# EAGLE design NextOne_R2 (EAGLE 9.6.0)
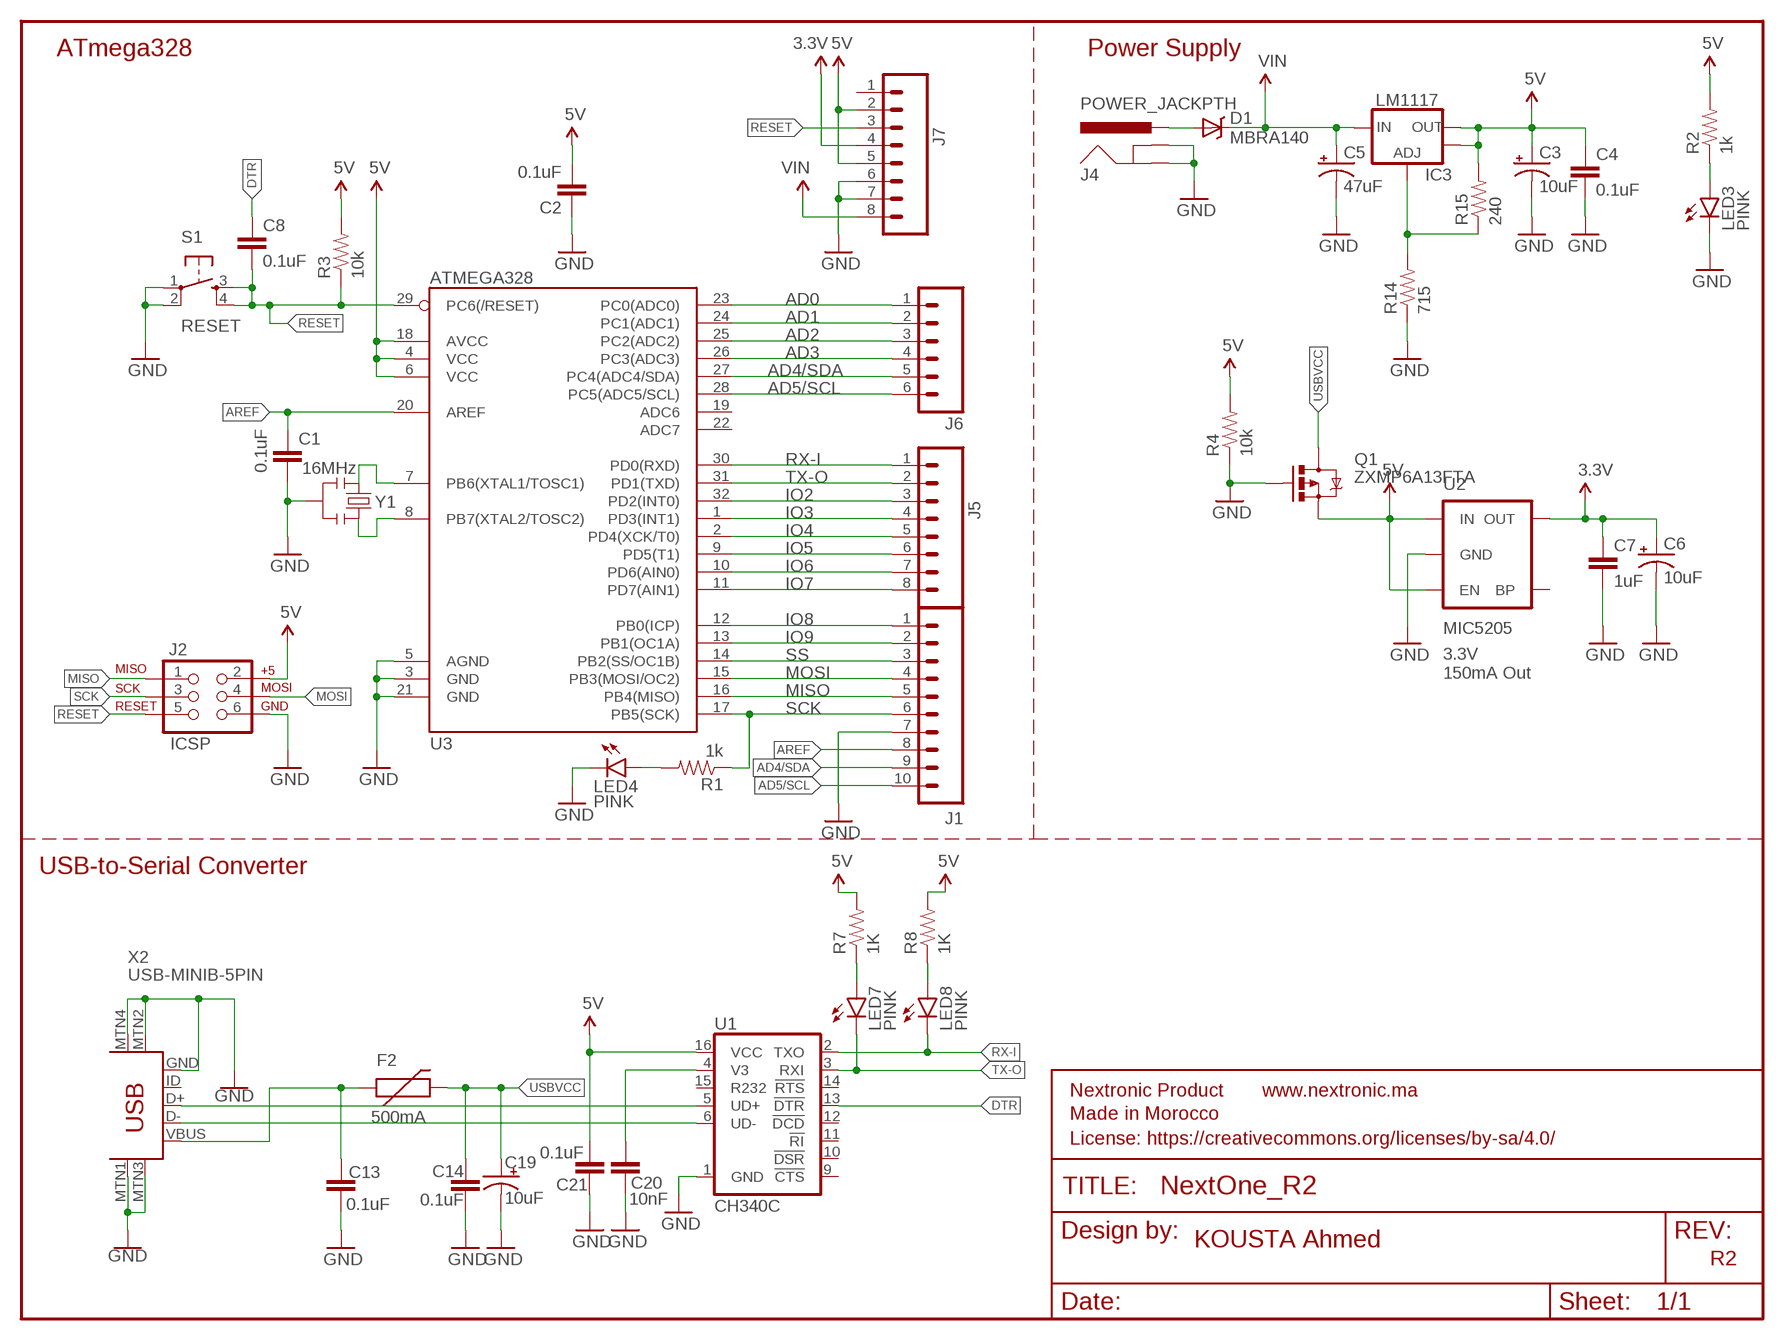
[diagram p0: schematic, sheet 1]

## Parts
C1  0.1uF  CAP0603-CAP  [0603-CAP]
C2  0.1uF  CAP0603-CAP  [0603-CAP]
C3  10uF  CAP_POL1206  [EIA3216]
C4  0.1uF  CAP0603-CAP  [0603-CAP]
C5  47uF  CAP_POLD  [PANASONIC_D]
C6  10uF  CAP_POL1206  [EIA3216]
C7  1uF  CAP0603-CAP  [0603-CAP]
C8  0.1uF  CAP0603-CAP  [0603-CAP]
C13  0.1uF  0.1UF-0603-25V-(+80/-20%)  [0603]
C14  0.1uF  0.1UF-0603-25V-(+80/-20%)  [0603]
C19  10uF  10UF-POLAR-EIA3216-16V-10%(TANT)  [EIA3216]
C20  10nF  10NF-0603-50V-10%  [0603]
C21  0.1uF  0.1UF-0603-25V-(+80/-20%)  [0603]
D1  MBRA140  DIODE-SCHOTTKY_  [SMA-DIODE]
F2  500mA  PTCSMD  [PTC-1206]
FRAME1  FRAME-LETTER  [CREATIVE_COMMONS]
IC3  LM1117  V_REG_LM1117ALT1  [SOT223-ALT1]
J1  M10SILK_FEMALE_PTH  [1X10]
J2  ICSP  AVR_SPI_PRG_6PTH  [2X3]
J4  POWER_JACKPTH  [POWER_JACK_PTH]
J5  M08  [1X08_ROUND]
J6  M06SILK_FEMALE_PTH  [1X06]
J7  M08  [1X08_ROUND]
LED3  PINK  LED-PINK1206  [LED-1206@1]
LED4  PINK  LED-PINK1206  [LED-1206@1]
LED7  PINK  LED-PINK1206  [LED-1206@1]
LED8  PINK  LED-PINK1206  [LED-1206@1]
Q1  ZXMP6A13FTA  MOSFET-PCHANNELSMD  [SOT23-3]
R1  1k  RESISTOR0603-RES  [0603-RES]
R2  1k  RESISTOR0603-RES  [0603-RES]
R3  10k  RESISTOR0603-RES  [0603-RES]
R4  10k  RESISTOR0603-RES  [0603-RES]
R7  1K  1KOHM-1/10W-1%(0603)  [0603-RES]
R8  1K  1KOHM-1/10W-1%(0603)  [0603-RES]
R14  715  RESISTOR0603-RES  [0603-RES]
R15  240  RESISTOR0603-RES  [0603-RES]
S1  RESET  TAC_SWITCHSMD  [TACTILE_SWITCH_SMD]
U1  CH340C  [SO016]
U2  MIC5205  V_REG_LDOSMD  [SOT23-5]
U3  ATMEGA328  ATMEGA168  [TQFP32-08]
X2  USB-MINIB-5PIN  [USB-MINIB]
Y1  16MHz  RESONATORSMD  [RESONATOR-SMD]

## Nets
3.3V: C6.A(+) C7.1 J7.4 U2.5(OUT)
5V: C2.2 C3.A(+) C4.1 C21.1 IC3.2(OUT) IC3.4(OUT) J2.2 J7.2 J7.5 Q1.2(S) R2.2 R3.2 R4.2 R7.2 R8.2 R15.2 U1.16(VCC) U2.1(IN) U2.3(EN) U3.4(VCC) U3.6(VCC) U3.18(AVCC)
AD0: J6.1 U3.23(PC0(ADC0))
AD1: J6.2 U3.24(PC1(ADC1))
AD2: J6.3 U3.25(PC2(ADC2))
AD3: J6.4 U3.26(PC3(ADC3))
AD4/SDA: J1.9 J6.5 U3.27(PC4(ADC4/SDA))
AD5/SCL: J1.10 J6.6 U3.28(PC5(ADC5/SCL))
AREF: C1.1 J1.8 U3.20(AREF)
D+1: U1.5(UD+) X2.D+
D-1: U1.6(UD-) X2.D-
DTR: C8.1 U1.13(!DTR)
GND: C1.2 C2.1 C3.C(-) C4.2 C5.- C6.C(-) C7.2 C13.2 C14.2 C19.- C20.2 C21.2 J1.7 J2.6 J4.GND J4.GNDBREAK J7.6 J7.7 LED3.C LED4.C Q1.1(G) R4.1 R14.1 S1.1 S1.2 U1.1(GND) U2.2(GND) U3.3(GND) U3.5(AGND) U3.21(GND) X2.GND X2.MTN1(MTN2) X2.MTN2(MTN3) X2.MTN3(MTN1) X2.MTN4 Y1.2
IO2: J5.3 U3.32(PD2(INT0))
IO3: J5.4 U3.1(PD3(INT1))
IO4: J5.5 U3.2(PD4(XCK/T0))
IO5: J5.6 U3.9(PD5(T1))
IO6: J5.7 U3.10(PD6(AIN0))
IO7: J5.8 U3.11(PD7(AIN1))
IO8: J1.1 U3.12(PB0(ICP))
IO9: J1.2 U3.13(PB1(OC1A))
MISO: J1.5 J2.1 U3.16(PB4(MISO))
MOSI: J1.4 J2.4 U3.15(PB3(MOSI/OC2))
N$1: LED4.A R1.2
N$2: LED3.A R2.1
N$3: U3.7(PB6(XTAL1/TOSC1)) Y1.1
N$4: U3.8(PB7(XTAL2/TOSC2)) Y1.3
N$5: D1.A J4.PWR
N$8: LED7.A R7.1
N$10: LED8.A R8.1
N$14: C20.1 U1.4(V3)
N$15: IC3.1(ADJ) R14.2 R15.1
RESET: C8.2 J2.5 J7.3 R3.1 S1.3 S1.4 U3.29(PC6(/RESET))
RX-I: J5.1 LED8.C U1.2(TXO) U3.30(PD0(RXD))
SCK: J1.6 J2.3 R1.1 U3.17(PB5(SCK))
SS: J1.3 U3.14(PB2(SS/OC1B))
TX-O: J5.2 LED7.C U1.3(RXI) U3.31(PD1(TXD))
USBVCC: C14.1 C19.+ F2.2 Q1.3(D)
VIN: C5.+ D1.C IC3.3(IN) J7.8
VUSB1 [power]: C13.1 F2.1 X2.VBUS
Unconnected: J7.1 U1.9(!CTS) U1.10(!DSR) U1.11(!RI) U1.12(!DCD) U1.14(!RTS) U1.15(R232) U2.4(BP) U3.19(ADC6) U3.22(ADC7) X2.ID

## Notes on the sheet
- ATmega328 | Power Supply
- 3.3V
  150mA Out
- USB-to-Serial Converter
- KOUSTA Ahmed
- R2

## Library data of the parts
C1 C2 C4 C8 = SparkFun:CAP: Capacitor Standard 0603 ceramic capacitor, and 0.1" leaded capacitor.; OC_FARNELL: unknown
C3 C6 = SparkFun:CAP_POL: Capacitor Polarized These are standard SMD and PTH capacitors. Normally 10uF, 47uF, and 100uF in electrolytic and tantalum varieties. Always verify the external diameter of the through hole cap, it varies with capacity, voltage, and manufacturer. The EIA devices should be standard.; OC_FARNELL: unknown
C5 = SparkFun:CAP_POL: Capacitor Polarized These are standard SMD and PTH capacitors. Normally 10uF, 47uF, and 100uF in electrolytic and tantalum varieties. Always verify the external diameter of the through hole cap, it varies with capacity, voltage, and manufacturer. The EIA devices should be standard.; MF: PANASONIC ELECTRONIC COMPONENTS; MPN: EEE1CA470SP; OC_FARNELL: 9696946
C7 = SparkFun:CAP: Capacitor Standard 0603 ceramic capacitor, and 0.1" leaded capacitor.; MF: WALSIN; MPN: 0805B104K500CT; OC_FARNELL: 2496944
C13 C14 C21 = SparkFun-Capacitors:0.1UF: 0.1µF ceramic capacitors A capacitor is a passive two-terminal electrical component used to store electrical energy temporarily in an electric field.; PROD_ID: CAP-00810
C19 = SparkFun-Capacitors:10UF-POLAR: 10.0µF polarized capacitors A capacitor is a passive two-terminal electrical component used to store electrical energy temporarily in an electric field.; PROD_ID: CAP-00811
C20 = SparkFun-Capacitors:10NF: 0.01uF/10nF/10,000pF ceramic capacitors A capacitor is a passive two-terminal electrical component used to store electrical energy temporarily in an electric field. CAP-09321; PROD_ID: CAP-00867
D1 = SparkFun:DIODE-SCHOTTKY; MF: DIODES INC.; MPN: B140-13-F; OC_FARNELL: 1843670
F2 = SparkFun:PTC: Resettable Fuse PTC Resettable Fuse. Spark Fun Electronics SKU : COM-08357; OC_FARNELL: 1700871; OC_NEWARK: unknown
FRAME1 = SparkFun-Aesthetics:FRAME-LETTER: Schematic Frame Standard 8.5x11 US Letter frame; OC_FARNELL: unknown
IC3 = Testing:V_REG_LM1117: Voltage Regulator LM1117 Standard adjustable voltage regulator but in SMD form. Spark Fun Electronics SKU : COM-00595; MF: STMICROELECTRONICS; MPN: LD1117S33TR; OC_FARNELL: 1202826
J1 = SparkFun-Connectors:M10: Header 10 Standard 10-pin 0.1" header. Use with straight break away headers (SKU : PRT-00116), right angle break away headers (PRT-00553), swiss pins (PRT-00743), machine pins (PRT-00117), and female headers (PRT-00115).; OC_FARNELL: unknown; PROD_ID: CONN-11563
J2 = SparkFun-Connectors:AVR_SPI_PRG_6: AVR ISP 6 Pin This is the reduced ISP connector for AVR programming. Common on Arduino. This footprint will take up less PCB space and can be used with a 10-pin to 6-pin adapter such as SKU: BOB-08508 **Special note about "TEST_POINT" package. The stop mask is on the top side, so if you want your programming test points to be on the bottom of your board, make sure to place this package on the bottom side of the board. This also ensure that the orientation to program from the bottom side will be correct.; OC_FARNELL: unknown
J4 = SparkFun-Connectors:POWER_JACK: Power Jack This is the standard 5.5mm barrel jack for power. The PTH is the most common, proven, reliable, footprint. The Slot footprint only works if the mill layer is transmitted to the PCB fab house so be warned. Mating wall wart : TOL-00298 (and others); OC_FARNELL: unknown; PROD_ID: CONN-08197
J5 J7 = SparkFun-Connectors:M08: Header 8 Standard 8-pin 0.1" header. Use with straight break away headers (SKU : PRT-00116), right angle break away headers (PRT-00553), swiss pins (PRT-00743), machine pins (PRT-00117), and female headers (PRT-00115).; OC_FARNELL: unknown; PROD_ID: CONN-08437
J6 = SparkFun-Connectors:M06: Header 6 Standard 6-pin 0.1" header. Use with straight break away headers (SKU : PRT-00116), right angle break away headers (PRT-00553), swiss pins (PRT-00743), machine pins (PRT-00117), and female headers (PRT-00115). Molex polarized connector foot print use with SKU : PRT-08094 with associated crimp pins and housings. NOTES ON THE VARIANTS LOCK and LOCK_LONGPADS... This footprint was designed to help hold the alignment of a through-hole component (i.e. 6-pin header) while soldering it into place. You may notice that each hole has been shifted either up or down by 0.005 of an inch from it's more standard position (which is a perfectly straight line). This slight alteration caused the pins (the squares in the middle) to touch the edges of the holes. Because they are alternating, it causes a "brace" to hold the component in place. 0.005 has proven to be the perfect amount of "off-center" position when using our standard breakaway headers. Although looks a little odd when you look at the bare footprint, once you have a header in there, the alteration is very hard to notice. Also,if you push a header all the way into place, it is covered up entirely on the bottom side. This idea of altering the position of holes to aid alignment will be further integrated into the Sparkfun Library for other footprints. It can help hold any component with 3 or more connection pins.; OC_FARNELL: unknown; PROD_ID: CONN-08437
LED3 LED4 = SparkFun-LED:LED-PINK: Various Pink LEDs Pink LEDs used in SFE Production LILYPAD- DIO-10415; PROD_ID: DIO-10415
LED7 LED8 = SparkFun-LED:LED-PINK: Various Pink LEDs Pink LEDs used in SFE Production LILYPAD- DIO-10415; OC_NEWARK: unknown; PROD_ID: DIO-10415
Q1 = SparkFun:MOSFET-PCHANNEL; MF: DIODES INC.; MPN: ZXMP6A13FTA; OC_FARNELL: 1843770RL
R1-R4 R14 R15 = SparkFun:RESISTOR: Resistor Basic schematic elements and footprints for 0603, 1206, and PTH resistors.; OC_FARNELL: unknown
R7 R8 = SparkFun-Resistors:1KOHM-1/10W-1%(0603): RES-07856; MF: VISHAY/DALE; MPN: CRCW25121K00JNEG; OC_NEWARK: 53K3939; PROD_ID: RES-07856
S1 = SparkFun:TAC_SWITCH: Momentary Switch Button commonly used for reset or general input. Spark Fun Electronics SKU : COM-00097; OC_FARNELL: unknown
U1 = SparkFun-IC-Comms:CH340C; PROD_ID: IC-14038
U2 = SparkFun:V_REG_LDO: Voltage Regulator LDO Standard 150mA LDO voltage regulator in SOT-23 layout. Micrel part MIC5205. BP (by-pass) pin is used to lower output noise with 470pF cap.; OC_FARNELL: unknown
U3 = SparkFun:ATMEGA168; MF: ATMEL; MPN: ATMEGA328P-AN; OC_FARNELL: 2443178
X2 = SparkFun-Connectors:USB-MINIB: Mini-USB "B" connector with 5th pin broken out. Created new symbol breaking out 5th "ID" pin in mini/micro USB connector spec. See: http://en.wikipedia.org/wiki/Mini_usb#Cables. Uses same footprint as 4-pin symbol. Also added pins to connect to mounting / shield pads if required (probably not generally needed as signals aren't shielded once they leave the connector).; PROD_ID: CONN-08193
Y1 = SparkFun-FreqCtrl:RESONATOR: Resonator Small SMD resonator. This is the itty bitty 10/20MHz resonators with built in caps. CSTCE10M0G55 and CSTCE20M0V53. Footprint has been reviewed closely but hasn't been tested yet.; OC_FARNELL: unknown

## Net classes
0 default: width 0.152 mm, drill 0.305 mm, clearance 0.152 mm
1 power: width 0.254 mm

## Board
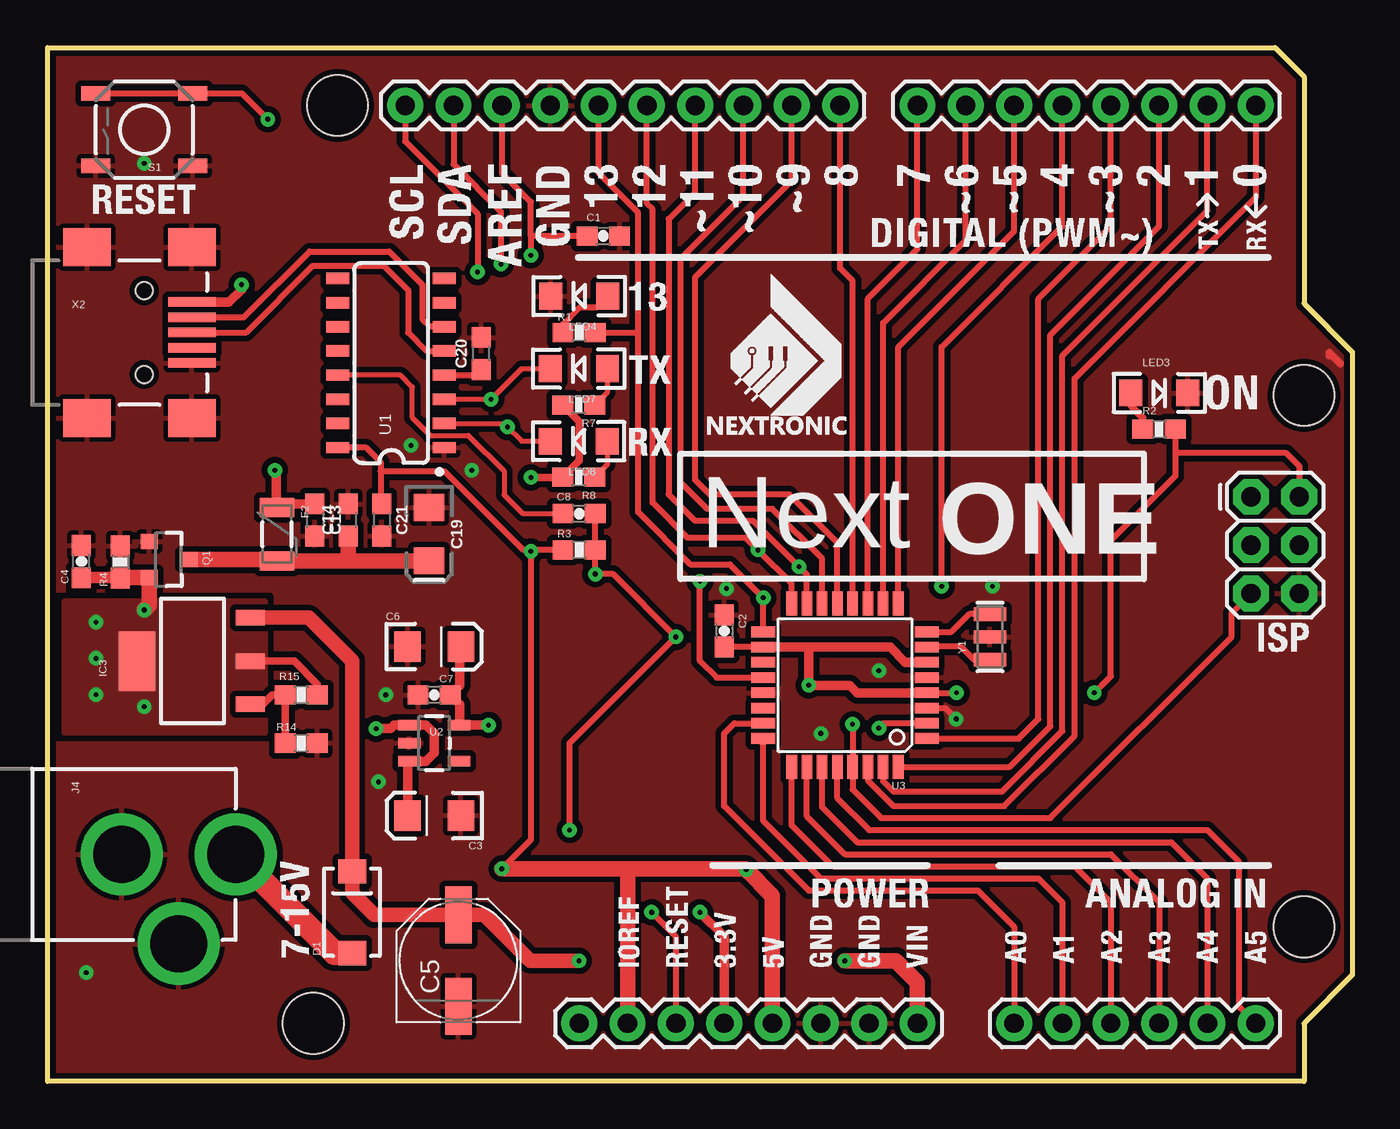
[diagram p1: board, top side]
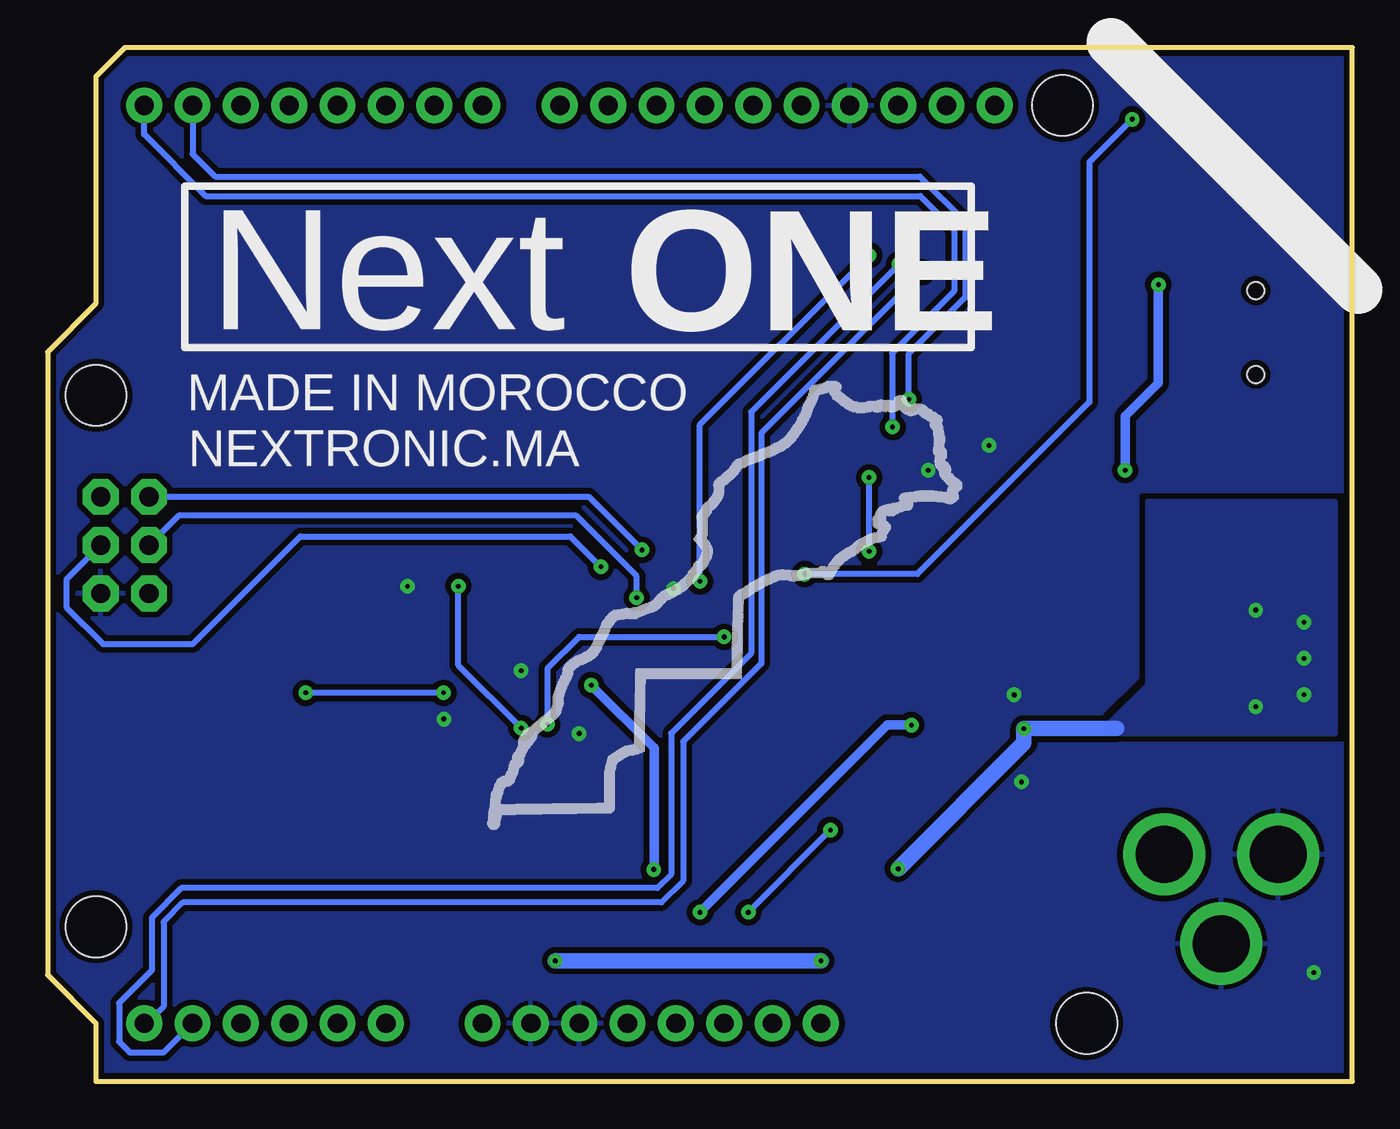
[diagram p2: board, bottom side, seen from below]

Size 68.58 x 54.36 mm. Coordinates in mm from the lower left corner, seen from the top.
Outline: 0,54.36 64.52,54.36 66.04,52.83 66.04,40.89 68.58,38.35 68.58,5.59 66.04,3.05 66.04,0 0,0 0,54.36
Copper layers (1*16): Top 0.035mm / dielectric 1.5mm / Bottom 0.035mm
Design rules "SparkFun-2-layer": minimum track width 7mil, minimum drill 15mil, track to track 8mil, track to pad 8mil, pad to pad 8mil, via to via 8mil, smd to smd 8mil, copper to edge 8mil, drill to drill 8mil, minimum pad ring 12mil, minimum via ring 10mil, stop-mask expansion 4mil, vias tented up to drill 20mil, thermal gap 10mil
Holes 3.2 mm at 13.97,3.05 66.04,8.13 66.04,36.07 15.24,51.31
vRestrict: area 0.6,22.4 to 2,30.6; area 5.7,23.1 to 7.4,30.6; area 47.9,10.8 to 48.5,11.3; area 50.4,10.7 to 50.9,11.6; area 11.3,29.3 to 12.7,31.6; area 0.3,13 to 9.4,25

### Footprints (pad centres in the part's own frame; a part is rotated, then mirrored left to right if it is on the bottom)
0603-CAP = smd 1.1 x 1: 1 -0.85,0; 2 0.85,0
EIA3216 = smd 1.4 x 1.6: A 1.4,0; C -1.4,0
PANASONIC_D = smd 3 x 1.4: + 2.4,0; - -2.4,0
0603 = smd 1.1 x 1: 1 -0.85,0; 2 0.85,0
EIA3216' = smd 1.4 x 1.6: + 1.4,0; - -1.4,0
SMA-DIODE = smd 1.27 x 1.47: A -2.15,0; C 2.15,0
PTC-1206 = smd 1 x 1.8: 1 -1.4,0; 2 1.4,0
SOT223-ALT1 = smd 0.813 x 1.524: 1 -2.271,-3.02; 2 0,-3.02; 3 2.288,-3.02 | smd 3.124 x 1.905: 4 0,2.921
1X10 = drill 1.016 pad 1.88: 1 0,0; 2 2.54,0; 3 5.08,0; 4 7.62,0; 5 10.16,0; 6 12.7,0; 7 15.24,0; 8 17.78,0; 9 20.32,0; 10 22.86,0
2X3 = drill 1.016 pad 1.88 octagon: 1 0,0; 2 0,2.54; 3 2.54,0; 4 2.54,2.54; 5 5.08,0; 6 5.08,2.54
POWER_JACK_PTH = drill 2.997 pad 4.318: GND 0,7.7; GNDBREAK 4.7,10.7; PWR 0,13.7
1X08_ROUND = drill 1.016 pad 1.88: 1 0,0; 2 2.54,0; 3 5.08,0; 4 7.62,0; 5 10.16,0; 6 12.7,0; 7 15.24,0; 8 17.78,0
1X06 = drill 1.016 pad 1.88: 1 0,0; 2 2.54,0; 3 5.08,0; 4 7.62,0; 5 10.16,0; 6 12.7,0
LED-1206@1 = smd 1.2 x 1.4: A -1.5,0; C 1.5,0
SOT23-3 = smd 0.8 x 0.9: 1 -0.95,-1; 2 0.95,-1; 3 0,1.1
0603-RES = smd 1.1 x 1: 1 -0.85,0; 2 0.85,0
TACTILE_SWITCH_SMD = smd 1.524 x 0.762: 1 -2.54,1.905; 2 2.54,1.905; 3 -2.54,-1.905; 4 2.54,-1.905
SO016 = smd 0.6 x 1.2: 1 -4.445,-2.8; 2 -3.175,-2.8; 3 -1.905,-2.8; 4 -0.635,-2.8; 5 0.635,-2.8; 6 1.905,-2.8; 7 3.175,-2.8; 8 4.445,-2.8; 9 4.445,2.8; 10 3.175,2.8; 11 1.905,2.8; 12 0.635,2.8; 13 -0.635,2.8; 14 -1.905,2.8; 15 -3.175,2.8; 16 -4.445,2.8
SOT23-5 = smd 0.55 x 1.2: 1 -0.95,-1.3; 2 0,-1.3; 3 0.95,-1.3; 4 0.95,1.3; 5 -0.95,1.3
TQFP32-08 = smd 1.27 x 0.559: 1 -4.293,2.8; 2 -4.293,2; 3 -4.293,1.2; 4 -4.293,0.4; 5 -4.293,-0.4; 6 -4.293,-1.2; 7 -4.293,-2; 8 -4.293,-2.8; 17 4.293,-2.8; 18 4.293,-2; 19 4.293,-1.2; 20 4.293,-0.4; 21 4.293,0.4; 22 4.293,1.2; 23 4.293,2; 24 4.293,2.8 | smd 0.559 x 1.27: 9 -2.8,-4.293; 10 -2,-4.293; 11 -1.2,-4.293; 12 -0.4,-4.293; 13 0.4,-4.293; 14 1.2,-4.293; 15 2,-4.293; 16 2.8,-4.293; 25 2.8,4.293; 26 2,4.293; 27 1.2,4.293; 28 0.4,4.293; 29 -0.4,4.293; 30 -1.2,4.293; 31 -2,4.293; 32 -2.8,4.293
USB-MINIB = smd 2.5 x 0.5: D+ 2.5,0; D- 2.5,0.8; GND 2.5,-1.6; ID 2.5,-0.8; VBUS 2.5,1.6 | smd 2.5 x 2: MTN1 -3,4.5; MTN2 2.5,4.5; MTN3 -3,-4.5; MTN4 2.5,-4.5 | hole 0.9: 0,2.2; 0,-2.2
RESONATOR-SMD = smd 0.7 x 1.7: 1 -1.2,0; 2 0,0; 3 1.2,0

### Placement (x,y rotation side)
C1  29.21,44.45 0 top
C2  35.56,23.68 270 top
C3  20.32,13.97 180 top
C4  1.78,27.33 90 top
C5  21.59,6.35 90 top
C6  20.32,22.86 0 top
C7  20.32,20.32 180 top
C8  27.94,29.84 0 top
C13  14.05,29.52 270 top
C14  15.8,29.52 90 top
C19  10uF  [EIA3216']  20.05,28.77 270 top
C20  22.8,38.27 90 top
C21  17.55,29.52 270 top
D1  16,8.89 90 top
F2  12.05,28.77 270 top
FRAME1  -0.81,-0.94 0 top
IC3  7.62,22.1 90 top
J1  41.66,51.31 180 top
J2  63.25,30.73 270 top
J4  -3.81,11.94 270 top
J5  63.5,51.31 180 top
J6  50.8,3.05 0 top
J7  27.94,3.05 0 top
LED3  58.42,36.19 0 top
LED4  27.95,41.29 180 top
LED7  27.93,37.48 180 top
LED8  27.92,33.66 180 top
Q1  6.35,27.43 270 top
R1  27.94,39.37 180 top
R2  58.42,34.29 0 top
R3  27.94,27.94 180 top
R4  3.81,27.3 270 top
R7  27.92,35.56 180 top
R8  27.92,31.77 180 top
R14  13.33,17.78 180 top
R15  13.33,20.32 0 top
S1  5.08,50.04 180 top
U1  18.05,37.77 90 top
U2  20.32,17.78 270 top
U3  41.91,20.83 180 top
X2  5.08,39.37 0 top
Y1  49.53,23.37 90 top

### Tracks (layer width: path | path; a pad name or v marks a point on that pad's centre or on a via)
3.3V  (via drill 0.25)
  Top 0.508: v23.18,18.73 U2.5 21.67,18.78 21.67,19.82 C7.1 21.67,20.82 21.67,22.81 C6.A | v34.29,8.89 35.56,7.62 J7.4
  Bottom 0.508: v34.29,8.89 25.53,17.65 25.52,17.65 24.45,18.73 v23.18,18.73
5V  (via drill 0.25)
  Top 0.305: U3.18 C2.2 | U3.4 v47.77,20.43 | v55.01,20.43 55.88,21.3 55.88,28.45 59.27,31.84 59.27,33.03 | 25.4,27.94 v25.4,27.87 25.4,12.7 v23.88,11.18 | J2.2 65.79,32.35 65.11,33.03 59.28,33.03 59.27,33.03 | R3.2 25.4,27.94 | 25.4,27.94 25,27.94 20.87,32.07 17.5,32.07 | C21.1 17.5,30.42 17.5,32.07 | 17.5,32.07 17.5,32.57 16.75,33.32 U1.16 | R2.2 59.27,33.03
  Top 0.406: IC3.2 12.95,22.1 14.19,20.87 R15.2 | R7.2 27.95,34.69 27.95,32.65 R8.2 27.05,31.75 v25.41,31.75
  Top 0.508: U3.6 45.09,22.03 44.29,22.83 40.01,22.83 | 40.01,22.83 U3.18 | 40.01,22.83 v40.01,20.83 42.16,20.83 42.56,20.43 U3.4 | C3.A 18.92,16.73 U2.3 19.88,16.83 20.32,17.27 20.32,18.29 19.88,18.73 U2.1 18.22,18.73 18.03,18.54 v17.27,18.54
  Top 0.61: C4.1 3.79,26.48 R4.2
  Top 0.813: v5.08,24.78 5.35,25.05 Q1.2 3.84,26.48 R4.2 | 30.4,11.18 36.68,11.18 v36.72,11.14 38.1,9.76 J7.5 | 30.4,11.18 v23.88,11.18 | 30.4,11.18 30.48,11.09 J7.2
  Bottom 0.305: v47.77,20.43 v55.01,20.43 | v25.4,27.87 v25.4,31.75 v25.41,31.75
  Bottom 0.508: v40.01,20.83 36.7,17.52 36.7,11.16 v36.72,11.14
  Bottom 0.813: v23.88,11.18 17.27,17.78 v17.27,18.54 12.4,18.54
  other vias: 2.54,22.24 5.08,19.7 2.54,20.33 2.54,24.14
  pour Bottom (isolate 0.305, no thermals): 0.89,30.48 10.79,30.48 10.79,20.83 12.7,18.92 12.7,18.29 0.89,18.29
  pour Top (isolate 0.305, no thermals): 0.89,18.29 0.89,25.27 11.43,25.27 11.43,18.29
AD0
  Top 0.305: U3.23 36.1,18.83 35.56,18.29 35.56,14.48 40.01,10.03 48.9,10.03 50.8,8.13 J6.1
AD1
  Top 0.305: U3.24 37.62,13.69 40.64,10.67 52.07,10.67 53.34,9.4 J6.2
AD2
  Top 0.305: U3.25 39.11,13.47 41.28,11.3 53.98,11.3 55.88,9.4 J6.3
AD3
  Top 0.305: U3.26 39.91,13.94 41.91,11.94 55.88,11.94 58.42,9.4 J6.4
AD4/SDA  (via drill 0.25)
  Top 0.305: U3.27 40.71,14.41 42.55,12.57 59.06,12.57 60.96,10.67 J6.5 | J1.9 21.34,48.21 23.83,45.72 v23.83,42.97
  Bottom 0.305: v23.83,42.97 31.6,35.2 31.6,22.51 35.81,18.3 35.81,10.88 36.53,10.16 61.55,10.16 63.1,8.61 63.1,5.84 64.82,4.12 64.82,2.09 64.26,1.52 62.48,1.52 J6.5
AD5/SCL  (via drill 0.25)
  Top 0.305: U3.28 41.51,14.88 43.18,13.21 60.96,13.21 62.6,11.57 62.6,3.95 J6.6 | J1.10 18.8,49.43 22.61,45.61 22.6,45.61 v22.6,42.55
  Bottom 0.305: J6.6 63.36,3.05 62.48,3.93 62.48,8.38 61.47,9.4 36.32,9.4 35.18,10.54 35.18,17.86 31.07,21.97 31.07,34.08 v22.6,42.55
AREF  (via drill 0.25)
  Top 0.305: U3.20 35.16,21.23 34.29,22.1 v34.29,26.29 | J1.8 23.88,47.75 25.4,46.23 25.4,44.45 | C1.1 25.4,44.45 | 25.4,44.45 v25.4,43.43
  Bottom 0.305: v34.29,26.29 34.29,34.54 25.7,43.14 v25.4,43.43
D+1
  Top 0.305: X2.D+ 10.43,39.37 13.95,42.88 17.67,42.88 18.95,41.61 18.95,39.36 19.9,38.4 U1.5
D-1
  Top 0.305: X2.D- 10.31,40.17 13.77,43.63 17.95,43.63 19.7,41.88 19.7,40.08 20.1,39.67 U1.6
DTR
  Top 0.254: U1.13 18.55,37.13 19.17,36.51 19.17,34.91 20.12,33.96 22.12,33.96 24,32.09 24,30.83 24.98,29.85 C8.1
GND  (via drill 0.25)
  Top 0.305: U3.3 47.17,19.63 v47.75,19.05
  Top 0.406: 67.35,38.17 67.35,38.32 67.94,37.73
  other vias: 5.08,48.26 40.64,18.29 43.69,21.59 49.66,26.03 35.69,25.91 2.03,5.71 17.78,20.32 17.4,15.75 19.1,33.43 22.3,32.13
  pour Top (isolate 0.305, rank 2): 0,54.36 64.52,54.36 66.04,52.83 66.04,40.89 68.58,38.35 68.58,5.59 66.04,3.05 66.04,0 0,0
  pour Bottom (isolate 0.305, rank 2): 0,54.36 64.52,54.36 66.04,52.83 66.04,40.89 68.58,38.35 68.58,5.59 66.04,3.05 66.04,0 0,0
IO2
  Top 0.305: U3.32 50.57,16.54 52.71,18.67 52.71,39.24 58.42,44.96 J5.3
IO3
  Top 0.305: U3.1 51.05,18.03 52.07,19.05 52.07,41.15 55.88,44.96 J5.4
IO4  (via drill 0.25)
  Top 0.305: v46.99,26.04 46.99,38.61 53.34,44.96 J5.5 | U3.2 43.94,18.83 v43.69,18.57
  Bottom 0.305: v43.69,18.57 46.99,21.88 v46.99,26.04
IO5
  Top 0.305: U3.9 44.71,38.61 50.8,44.7 J5.6
IO6
  Top 0.305: U3.10 43.91,39.88 48.26,44.23 J5.7
IO7
  Top 0.305: U3.11 43.11,41.15 45.72,43.76 J5.8
IO8
  Top 0.305: U3.12 42.31,42.1 41.66,42.75 J1.1
IO9
  Top 0.305: J1.2 39.12,47.35 34.04,42.27 34.04,31.62 34.8,30.86 38.99,30.86 41.51,28.34 U3.13
MISO  (via drill 0.25)
  Top 0.305: U3.16 39.11,26.17 v37.34,27.94 36.7,28.58 33.66,28.58 31.8,30.43 31.8,45.85 31.5,46.15 J1.5
  Bottom 0.305: J2.1 63.24,30.75 40.14,30.75 v37.34,27.94
MOSI  (via drill 0.25)
  Top 0.305: U3.15 39.91,26.64 v39.5,27.05 37.08,29.46 34.04,29.46 32.64,30.86 32.64,45.34 34.04,46.74 J1.4
  Bottom 0.305: v39.5,27.05 41.1,28.65 55.3,28.65 60.96,22.99 65.66,22.99 67.56,24.89 67.56,26.42 J2.4
N$1
  Top 0.305: R1.2 27.09,39.82 27.97,40.7 28.86,40.7 LED4.A
N$2
  Top 0.305: 56.92,35.54 LED3.A
  Top 0.356: R2.1 57.57,34.89 56.92,35.54
N$3
  Top 0.305: Y1.1 48.7,22.17 48.01,22.86 46.17,22.86 U3.7
N$4
  Top 0.305: U3.8 47.5,23.63 48.44,24.57 Y1.3
N$5
  Top 1.27: D1.A 15.09,6.74 J4.PWR
N$8
  Top 0.254: LED7.A 29.43,36.22 R7.1
N$10
  Top 0.254: LED8.A 29.42,32.42 R8.1
N$14
  Top 0.305: U1.4 22.52,37.13 C20.1
N$15
  Top 0.406: IC3.1 11.32,19.83 11.81,20.32 R15.1 R14.2
RESET  (via drill 0.25)
  Top 0.305: v42.31,18.78 U3.29 42.31,15.35 43.82,13.84 52.71,13.84 62.23,23.37 62.23,24.64 J2.5 | S1.4 S1.3 10.21,51.94 v11.57,50.58 | C8.2 R3.1 v28.79,26.67 29.72,26.67 v33.02,23.37 27.43,17.78 v27.43,13.21 | v31.75,8.89 33.02,7.62 J7.3
  Bottom 0.305: v42.31,18.78 42.31,21.7 40.64,23.37 v33.02,23.37 | v28.79,26.67 22.86,26.67 13.82,35.71 13.82,48.33 v11.57,50.58 | v31.75,8.89 v27.43,13.21
RX-I  (via drill 0.25)
  Top 0.254: 63.5,46.86 63.52,46.88 | U1.2 23.98,34.59 v24.17,34.41 24.92,33.66 LED8.C
  Top 0.305: U3.30 43.11,15.82 44.45,14.48 50.29,14.48 53.98,18.16 53.98,36.95 63.5,46.48 63.5,46.86 | 63.52,46.88 63.52,51.29 J5.1
  Bottom 0.305: v24.17,34.41 24.2,34.44 24.2,38.28 20.94,41.54 20.94,44.78 22.71,46.55 60.26,46.55 63.5,49.79 J5.1
SCK  (via drill 0.25)
  Top 0.305: U3.17 v37.62,25.43 35.87,27.18 33.78,27.18 31.04,29.92 31.04,39.37 | R1.1 31.04,39.37 | 31.04,39.37 31.04,45.67 28.96,47.75 J1.6
  Bottom 0.305: v37.62,25.43 37.62,26.57 40.8,29.75 61.69,29.75 J2.3
SS
  Top 0.305: J1.3 36.58,46.55 33.27,43.25 33.27,31.5 34.67,30.1 38.1,30.1 40.71,27.49 U3.14
TX-O  (via drill 0.25)
  Top 0.254: U1.3 v23.31,35.86 24.93,37.48 LED7.C
  Top 0.305: U3.31 43.91,15.78 44.45,15.24 50.17,15.24 53.34,18.42 53.34,38.17 60.96,45.79 J5.2
  Bottom 0.305: J5.2 60.96,48.76 59.78,47.58 22.73,47.58 20.35,45.19 20.35,41.23 23.31,38.27 v23.31,35.86
USBVCC
  Top 0.813: Q1.3 11.99,27.43 F2.2 15.7,27.37 | 15.7,27.37 C19.+ | C14.1 15.8,27.47 15.7,27.37
VIN  (via drill 0.25)
  Top 0.762: v27.93,6.34 25.37,6.34 22.96,8.75 C5.+ 17.16,8.75 16,9.91 D1.C 16,22.1 13.72,24.39 IC3.3
  Top 0.813: v41.9,6.34 44.59,6.34 45.72,5.21 J7.8
  Bottom 0.813: v27.93,6.34 v41.9,6.34
VUSB1  (via drill 0.25)
  Top 0.508: C13.1 12.25,30.37 F2.1 12.02,30.13 12.02,32.06 v11.95,32.13 | X2.VBUS 9.53,40.97 10.2,41.63 v10.2,41.88
  Bottom 0.508: v10.2,41.88 10.21,41.87 10.21,36.71 11.95,34.97 v11.95,32.13

### Text on the board
tPlace: Next | ONE
bPlace: ONE | Next | MADE IN MOROCCO | NEXTRONIC.MA
214bmp: D:/SmartProjects/Snc/a4_bn_logo2.bmp